# Altium schematic sheet led.SchDoc
size A; SheetNumber: 1; SheetTotal: 1
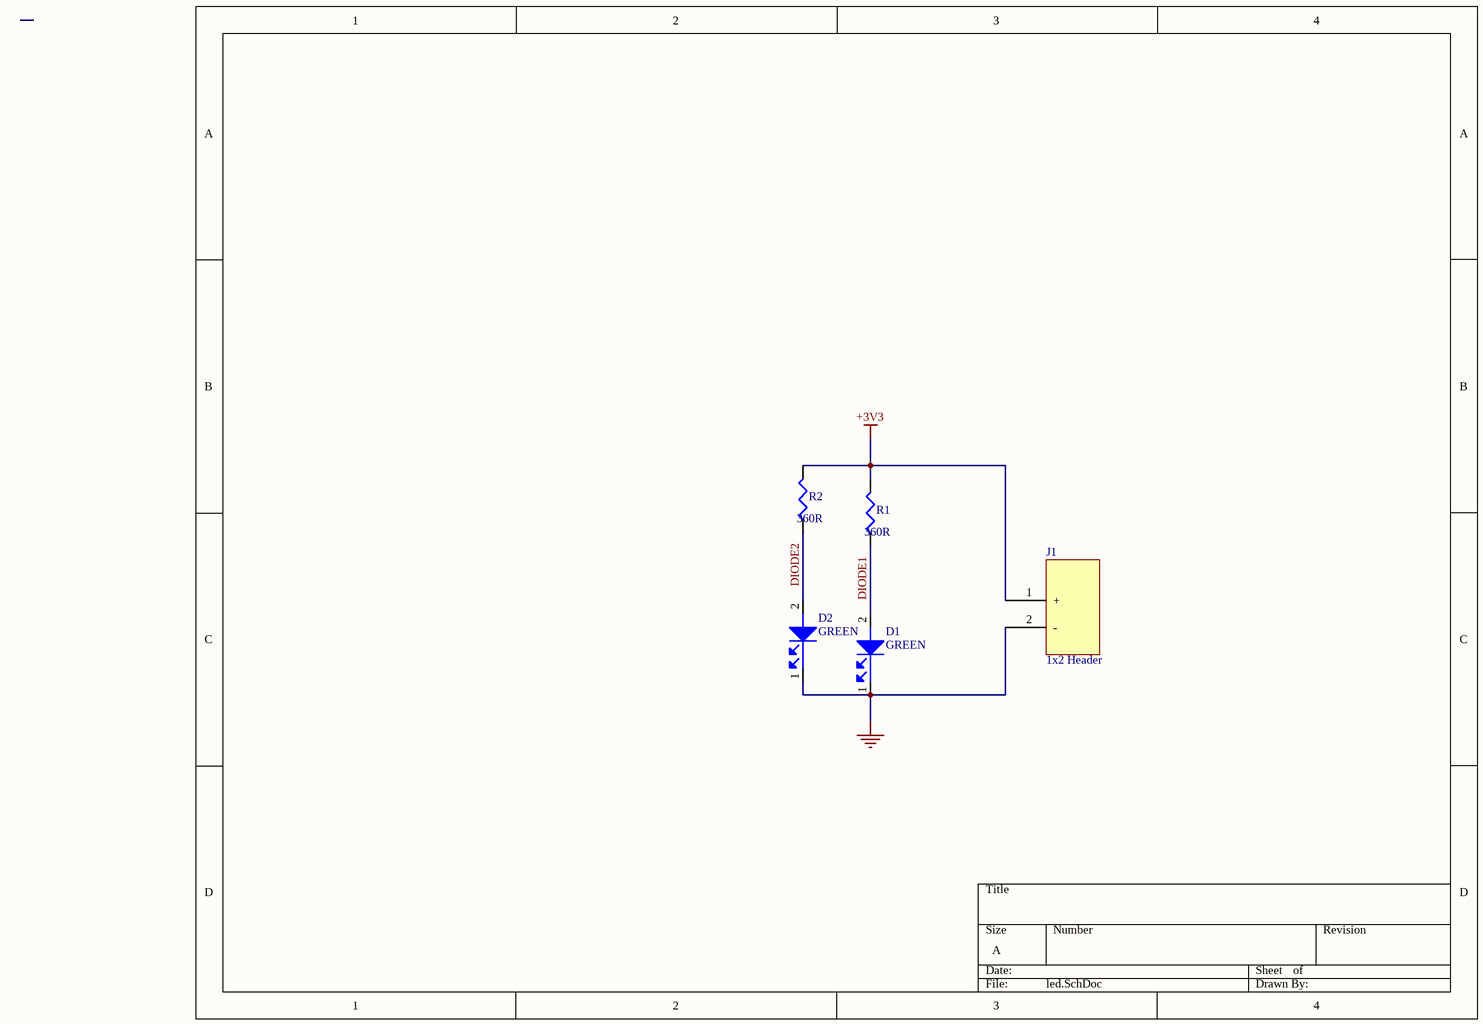
[diagram p0: led.SchDoc]

## Parts
D1  GREEN  [LED0603G]
D2  GREEN  [LED0603G]
J1  1x2 Header  [HDR1x2]
R1  360R  [R0805 - duplicate]
R2  360R  [R0805 - duplicate]

## Nets
+3V3: J1.1(+) R1.2 R2.2
VCC: D1.1 D2.1 J1.2(-)
DIODE1: D1.2 R1.1
DIODE2: D2.2 R2.1

## Library data of the parts
D1 D2 = LSM0603453V: LED GREEN CLEAR CHIP 0603 SMD; Manufacturer: Visual Communications; Forward Current: 20mA; Power Dissipation: 60mW; Reverse Voltage: 5V; Wavelength: 576nm; Supplier: Digi-Key; Supplier Part Number: LSM0603453VCT-ND; Manufacturer Part Number: LSM0603453V; RoHS: Yes; Category: LEDs; Stock: 93994; Pricing: 1=0.39, 10=0.242, 100=0.1394, 1000=0.10908, 2000=0.09999 (USD); Min Operating Temperature: -40°C; Max Operating Temperature: 85°C; ComponentLink1URL: http://www.farnell.com/datasheets/2699708.pdf?src-supplier=Farnell; ComponentLink1Description: http://www.farnell.com/datasheets/2699708.pdf?src-supplier=Farnell; ComponentLink2URL: http://www.farnell.com/datasheets/2699708.pdf?src-supplier=Newark; ComponentLink2Description: http://www.farnell.com/datasheets/2699708.pdf?src-supplier=Newark; ComponentLink3URL: https://vcclite.com/wp-content/uploads/wpallimport/files/files/LSM0603453V.pdf?src-supplier=Digi-Key; ComponentLink3Description: https://vcclite.com/wp-content/uploads/wpallimport/files/files/LSM0603453V.pdf?src-supplier=Digi-Key
J1 = 22-27-2021: CONN HEADER VERT 2POS 2.54MM; Manufacturer: Molex; Plating: 154ConductorMaterial; Current Rating: 4A; Voltage Rating: 500V; Number of Positions: 2; Gender: Male; Voltage Rating (DC): 250V; Supplier: Digi-Key; Supplier Part Number: WM4111-ND; Manufacturer Part Number: 22-27-2021; RoHS: Yes; Category: Headers and Wire Housings; Stock: 107358; Pricing: 1=0.3, 10=0.245, 100=0.18, 1000=0.14317, 5000=0.12272, 10000=0.11453 (USD); Contact Plating: Tin; Contact Material: Tin; Housing Color: Natural; Material: Nylon; Housing Material: Nylon; Weight: 0.00769oz; Number of Rows: 1; Package Quantity: 24000; Contact Gender: Male; Packaging: Bulk; Termination: Through Hole; Series: 6410; Contact Type: -; Pitch: 2.54mm; RoHS Compliant: Yes; Lead Free: Lead Free; Flammability Rating: UL94 V-0; Reach SVHC Compliant: 4187SVHC
R1 R2 = AC0805FR-07360RL: RES SMD 360 OHM 1% 1/8W 0805; Manufacturer: Yageo; Max Power Dissipation: 125mW; Temperature Coefficient: 100ppm/°C; Supplier: Digi-Key; Supplier Part Number: 13-AC0805FR-07360RLTR-ND; Manufacturer Part Number: AC0805FR-07360RL; RoHS: Yes; Category: Chip SMD Resistors; Pricing: 5000=0.00699, 10000=0.00621, 25000=0.0054, 35000=0.00526, 50000=0.00491, 125000=0.00448 (USD); Case/Package: 0805; Min Operating Temperature: -55°C; Max Operating Temperature: 155°C; Value: 360R; Tolerance: 1%; Packaging: Tape and Reel; Number of Terminations: 2; Features: Moisture Resistant,Automotive AEC-Q200; Series: AC; Length: 0.079inch; Width: 0.049inch; Height: 0.024inch; RoHS Compliant: Yes; ComponentLink1URL: http://www.yageo.com/NewPortal/yageodocoutput?fileName=/pdf/R-Chip/PYu-AC_51_RoHS_L_6.pdf&src-supplier=Digi-Key; ComponentLink1Description: http://www.yageo.com/NewPortal/yageodocoutput?fileName=/pdf/R-Chip/PYu-AC_51_RoHS_L_6.pdf&src-supplier=Digi-Key